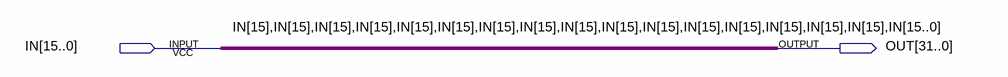
[diagram p0: schematic sheet]
// Quartus schematic Extensao_de_sinal.bdf as structural Verilog: 0 symbols, 2 pins
module Extensao_de_sinal (
  input  [15:0] IN,
  output [31:0] OUT
);


  assign OUT = {{17{IN[15]}}, IN[14:0]};
endmodule
